# EAGLE design Temporizador (EAGLE 6.4)
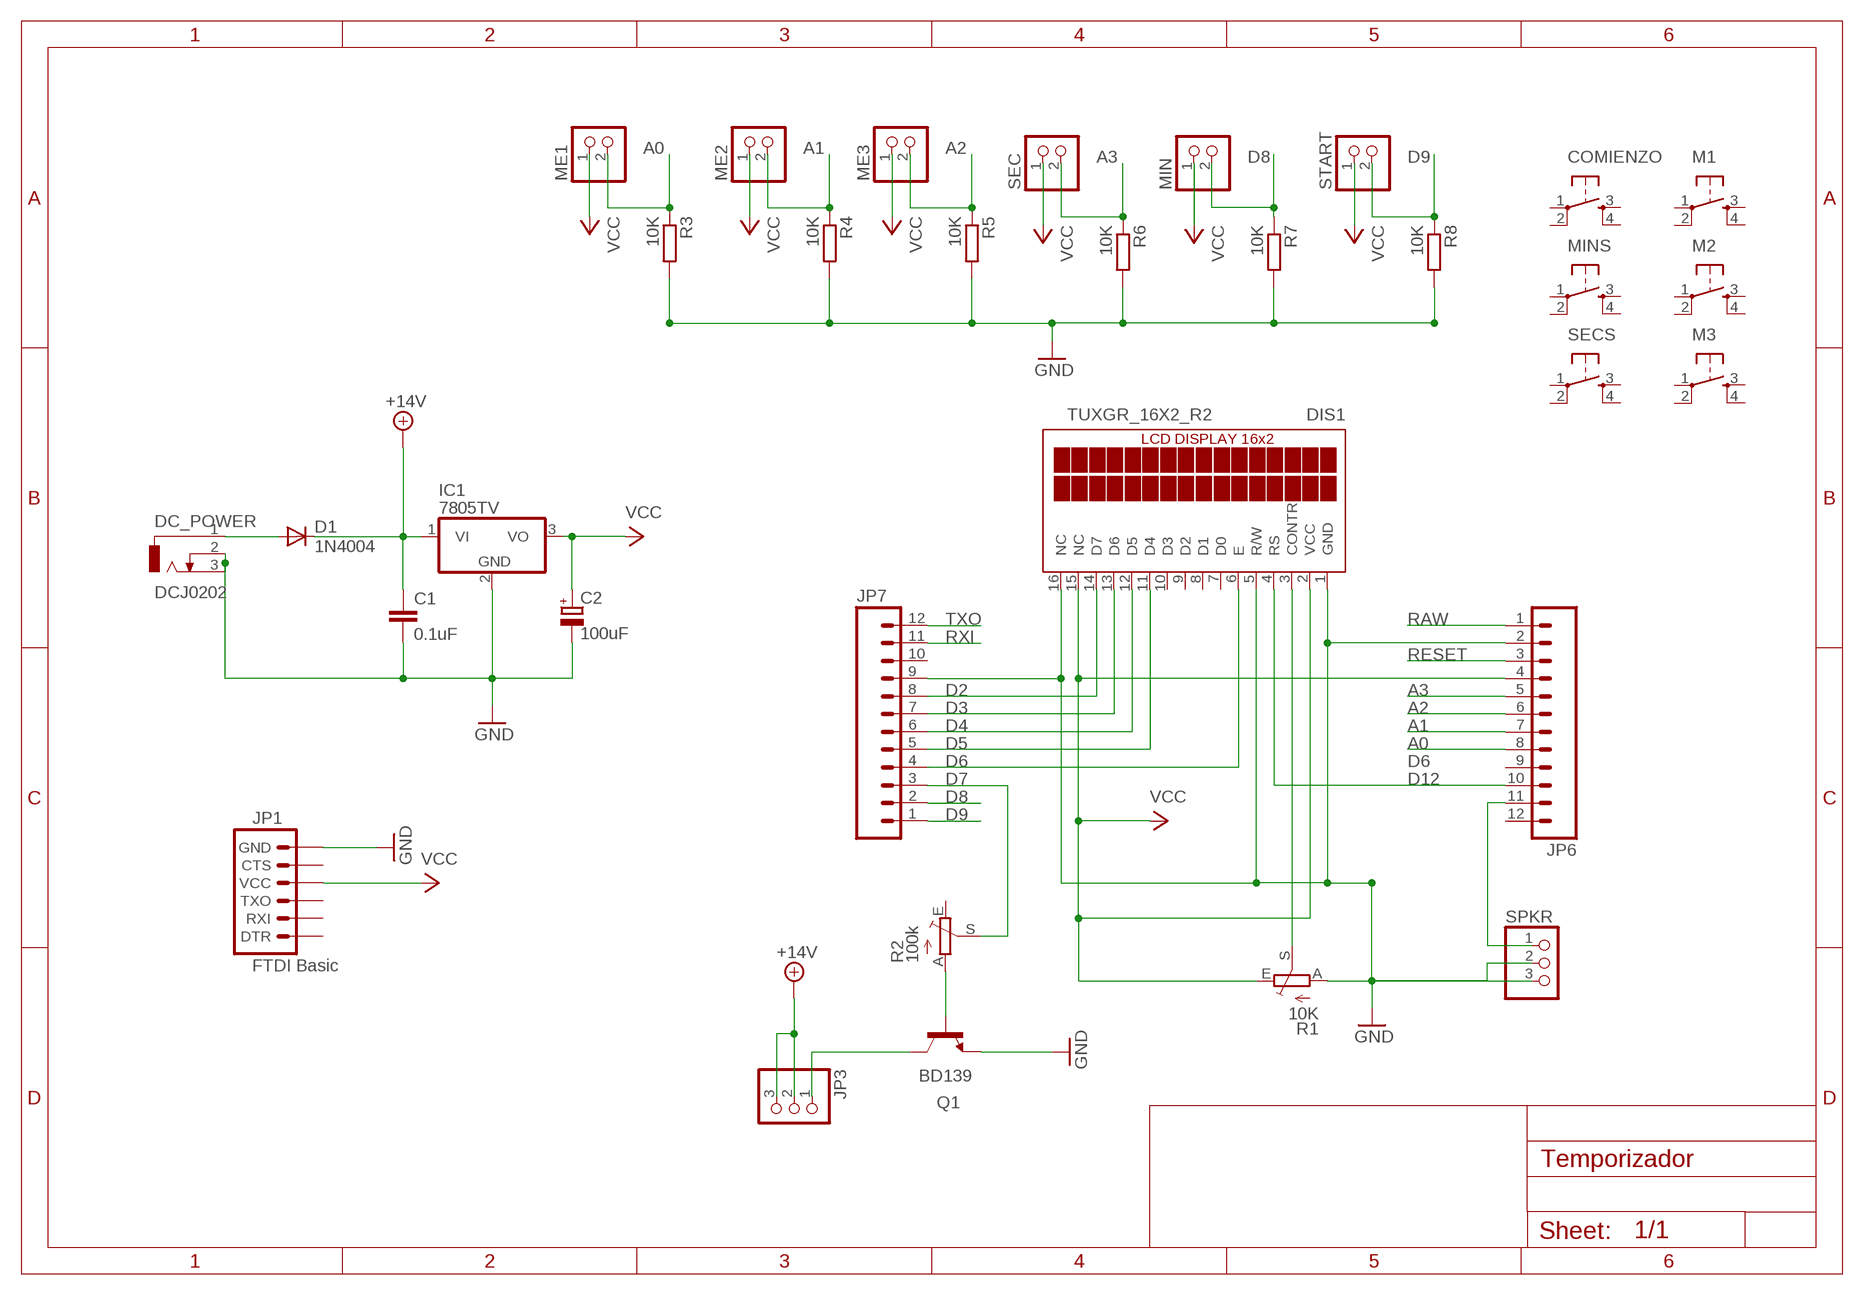
[diagram p0: schematic, sheet 1]

## Parts
C1  0.1uF  C-EU025-030X050  [C025-030X050]
C2  100uF  CPOL-EUE2.5-7  [E2,5-7]
COMIENZO  TAC_SWITCHPTH  [TACTILE-PTH]
D1  1N4004  [DO41-10]
DC_POWER  DCJ0202  [DCJ0202]
DIS1  TUXGR_16X2_R2  [TUXGR_16X2_R2]
IC1  7805TV  [TO220V]
JP1  FTDI Basic  ARDUINO_SERIAL_PROGRAMPTH  [1X06]
JP3  PINHD-1X3  [1X03]
JP6  M12LONGPADS  [1X12_LONGPADS]
JP7  M12LONGPADS  [1X12_LONGPADS]
M1  TAC_SWITCHPTH  [TACTILE-PTH]
M2  TAC_SWITCHPTH  [TACTILE-PTH]
M3  TAC_SWITCHPTH  [TACTILE-PTH]
ME1  PINHD-1X2  [1X02]
ME2  PINHD-1X2  [1X02]
ME3  PINHD-1X2  [1X02]
MIN  PINHD-1X2  [1X02]
MINS  TAC_SWITCHPTH  [TACTILE-PTH]
Q1  BD139  [TO126]
R1  10K  TRIM_EU-CA6V  [CA6V]
R2  100k  TRIM_EU-CA6V  [CA6V]
R3  10K  R-EU_0309/12  [0309/12]
R4  10K  R-EU_0309/12  [0309/12]
R5  10K  R-EU_0309/12  [0309/12]
R6  10K  R-EU_0309/12  [0309/12]
R7  10K  R-EU_0309/12  [0309/12]
R8  10K  R-EU_0309/12  [0309/12]
SEC  PINHD-1X2  [1X02]
SECS  TAC_SWITCHPTH  [TACTILE-PTH]
SPKR  PINHD-1X3  [1X03]
START  PINHD-1X2  [1X02]

## Nets
+14V: C1.1 D1.C IC1.1(VI) JP3.2 JP3.3
A0: JP6.8 ME1.2 R3.1
A1: JP6.7 ME2.2 R4.1
A2: JP6.6 ME3.2 R5.1
A3: JP6.5 R6.1 SEC.2
D2: DIS1.14(D7) JP7.8
D3: DIS1.13(D6) JP7.7
D4: DIS1.12(D5) JP7.6
D5: DIS1.11(D4) JP7.5
D6: DIS1.6(E) JP7.4
D7: JP7.3 R2.S
D8: JP7.2 MIN.2 R7.1
D9: JP7.1 R8.1 START.2
D12: DIS1.4(RS) JP6.10
GND: C1.2 C2.- DC_POWER.2 DC_POWER.3 DIS1.1(GND) DIS1.5(R/W) DIS1.16(NC) IC1.2(GND) JP1.6(GND) JP6.2 JP7.9 Q1.1(E) R1.A R3.2 R4.2 R5.2 R6.2 R7.2 R8.2 SPKR.2 SPKR.3
N$1: DIS1.3(CONTR) R1.S
N$2: JP6.11 SPKR.1
N$3: Q1.3(B) R2.A
N$4: JP3.1 Q1.2(C)
N$5: D1.A DC_POWER.1
RAW [vcc]: JP6.1
RESET: JP6.3
RXI: JP7.11
TXO: JP7.12
VCC [vcc]: C2.+ DIS1.2(VCC) DIS1.15(NC) IC1.3(VO) JP1.4(VCC) JP6.4 ME1.1 ME2.1 ME3.1 MIN.1 R1.E SEC.1 START.1
Unconnected: COMIENZO.1 COMIENZO.2 COMIENZO.3 COMIENZO.4 DIS1.7(D0) DIS1.8(D1) DIS1.9(D2) DIS1.10(D3) JP1.1(DTR) JP1.2(RXI) JP1.3(TXO) JP1.5(CTS) JP6.9 JP6.12 JP7.10 M1.1 M1.2 M1.3 M1.4 M2.1 M2.2 M2.3 M2.4 M3.1 M3.2 M3.3 M3.4 MINS.1 MINS.2 MINS.3 MINS.4 R2.E SECS.1 SECS.2 SECS.3 SECS.4

## Library data of the parts
C1 = rcl:C-EU: CAPACITOR, European symbol
C2 = rcl:CPOL-EU: POLARIZED CAPACITOR, European symbol
COMIENZO M1-M3 MINS SECS = SparkFun-Electromechanical:TAC_SWITCH: Momentary Switch Button commonly used for reset or general input. Spark Fun Electronics SKU : COM-00097 SMT- SWCH-08247
D1 = diode:1N4004: DIODE general purpose rectifier, 1 A
DC_POWER = con-jack:DCJ0202: DC POWER JACK Source: DCJ0202.pdf; OC_FARNELL: unknown; OC_NEWARK: unknown
DIS1 = display-lcd:TUXGR_16X2_R2: Tuxgraphics LCD display 16x2 characters reflective, without background light Source: tuxgr_12x2_r2.pdf; OC_FARNELL: unknown; OC_NEWARK: unknown
IC1 = linear:78*: Positive VOLTAGE REGULATOR Source: http://cache.national.com/ds/LM/LM78L05.pdf http://www.fairchildsemi.com/ds/LM/LM7805.pdf
JP1 = SparkFun:ARDUINO_SERIAL_PROGRAM
JP3 SPKR = pinhead:PINHD-1X3: PIN HEADER
JP6 JP7 = SparkFun-Connectors:M12: Header 12 Standard 12-pin 0.1" header. Use with straight break away headers (SKU : PRT-00116), right angle break away headers (PRT-00553), swiss pins (PRT-00743), machine pins (PRT-00117), and female headers (PRT-00115).
ME1-ME3 MIN SEC START = pinhead:PINHD-1X2: PIN HEADER
Q1 = transistor-npn:BD139*: NPN Transistor
R1 R2 = pot:TRIM_EU-: POTENTIOMETER
R3-R8 = rcl:R-EU_: RESISTOR, European symbol

## Net classes
0 default: width 0.203 mm
1 vcc: width 0.254 mm

## Board
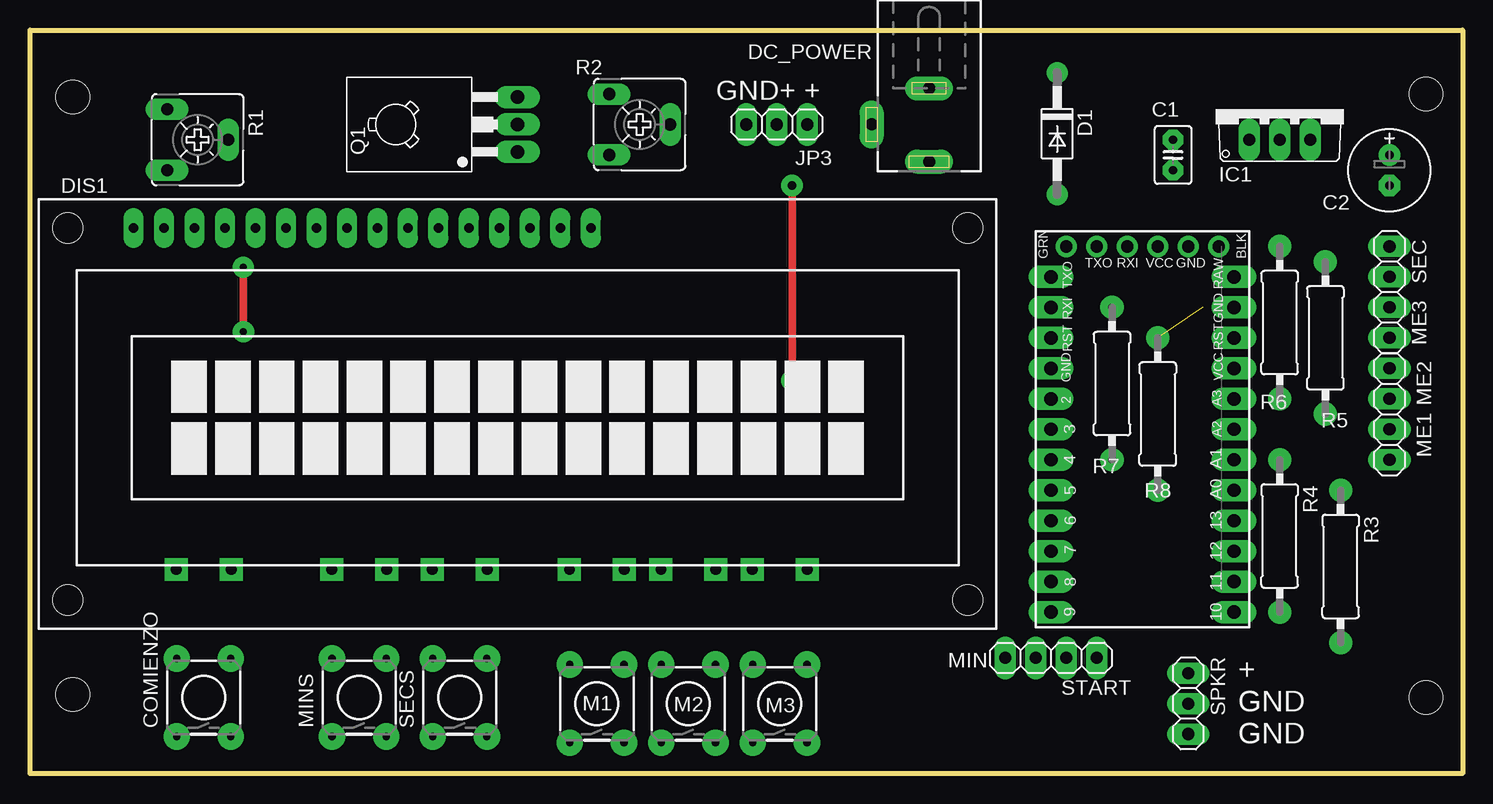
[diagram p1: board, top side]
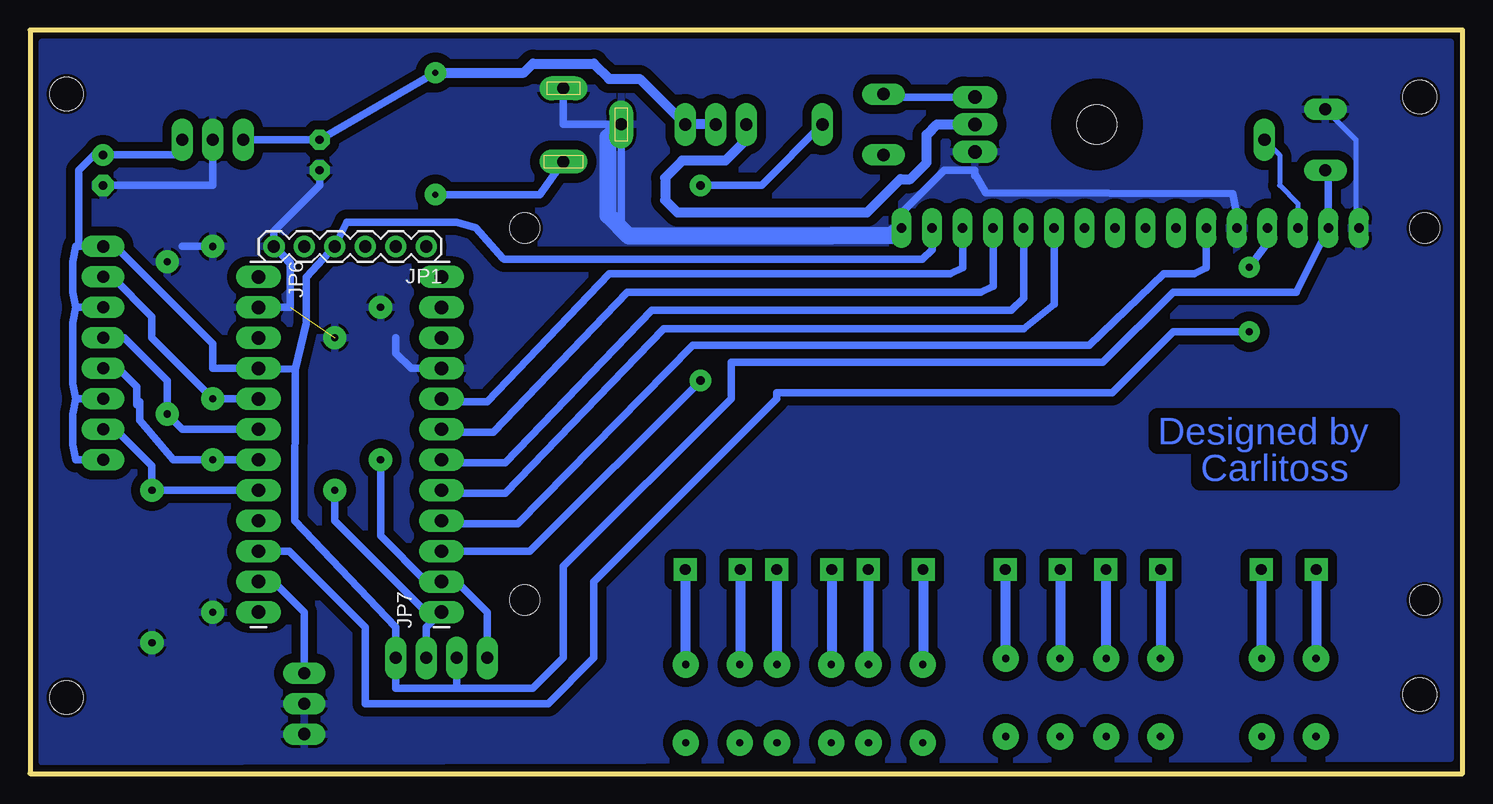
[diagram p2: board, bottom side, seen from below]

Size 119.38 x 61.98 mm. Coordinates in mm from the lower left corner, seen from the top.
Outline: 0,61.98 119.38,61.98 119.38,0 0,0 0,61.98
Copper layers (1*16): Top 0.035mm / dielectric 1.5mm / Bottom 0.035mm
Design rules "default *": minimum track width 8mil, minimum drill 20mil, track to track 30mil, track to pad 25mil, pad to pad 25mil, via to via 20mil, smd to smd 8mil, copper to edge 10mil, drill to drill 8mil, minimum pad ring 15mil, minimum via ring 20mil, stop-mask expansion 4mil, vias tented up to drill 20mil, thermal gap 10mil
Holes 2.8 mm at 3.56,6.6 3.56,56.39 116.33,56.64 116.33,6.35

### Footprints (pad centres in the part's own frame; a part is rotated, then mirrored left to right if it is on the bottom)
C025-030X050 = drill 0.7 pad 1.676 octagon: 1 -1.27,0; 2 1.27,0
E2,5-7 = drill 0.7 pad 1.778: + -1.27,0 | drill 0.7 pad 1.778 octagon: - 1.27,0
TACTILE-PTH = drill 0.6 pad 2.184: 1 -3.251,2.261; 2 3.251,2.261; 3 -3.251,-2.261; 4 3.251,-2.261
DO41-10 = drill 0.5 pad 1.778: A 5.08,0; C -5.08,0
DCJ0202 = drill 1 pad 2 long: 1 0,3.1; 2 4.8,0; 3 0,-3
TUXGR_16X2_R2 = drill 0.8 pad 1.676 long: 1 -32,15.5; 2 -29.46,15.5; 3 -26.92,15.5; 4 -24.38,15.5; 5 -21.84,15.5; 6 -19.3,15.5; 7 -16.76,15.5; 8 -14.22,15.5; 9 -11.68,15.5; 10 -9.14,15.5; 11 -6.6,15.5; 12 -4.06,15.5; 13 -1.52,15.5; 14 1.02,15.5; 15 3.56,15.5; 16 6.1,15.5 | hole 2.5: -37.5,-15.5; 37.5,-15.5; -37.5,15.5; 37.5,15.5
TO220V = drill 1.016 long: 1 -2.54,-2.54; 2 0,-2.54; 3 2.54,-2.54
1X06 = drill 1.016: 1 0,0; 2 2.54,0; 3 5.08,0; 4 7.62,0; 5 10.16,0; 6 12.7,0
1X03 = drill 1.016 long: 1 -2.54,0; 2 0,0; 3 2.54,0
1X12_LONGPADS = drill 1.118 pad 1.88 long: 1 0,0; 2 2.54,0; 3 5.08,0; 4 7.62,0; 5 10.16,0; 6 12.7,0; 7 15.24,0; 8 17.78,0; 9 20.32,0; 10 22.86,0; 11 25.4,0; 12 27.94,0
1X02 = drill 1.016 long: 1 -1.27,0; 2 1.27,0
TO126 = drill 1.118 long: 1 -2.286,-5.08; 2 0,-5.08; 3 2.286,-5.08 | hole 3.302: 0,5.08
CA6V = drill 1.016 long: A -2.54,-2.54; E 2.54,-2.54; S 0,2.54
0309/12 = drill 0.6 pad 1.93: 1 -6.35,0; 2 6.35,0

### Placement (x,y rotation side)
C1  95.25,51.56 270 top
C2  113.28,50.29 270 top
COMIENZO  14.48,6.35 90 top
D1  85.6,53.34 270 top
DC_POWER  74.93,54.1 180 top
DIS1  40.64,29.97 0 top
IC1  104.14,55.37 0 top
JP1  86.36,43.94 180 bottom
JP3  62.23,54.1 0 top
JP6  100.33,41.4 270 bottom
JP7  85.09,13.46 90 bottom
M1  47.24,5.84 90 top
M2  54.86,5.84 90 top
M3  62.48,5.84 90 top
ME1  113.28,27.43 90 top
ME2  113.28,32.51 90 top
ME3  113.28,37.59 270 top
MIN  82.55,9.65 180 top
MINS  27.43,6.35 90 top
Q1  35.56,54.1 90 top
R1  13.97,52.83 270 top
R2  50.8,54.1 270 top
R3  109.22,17.27 270 top
R4  104.14,19.81 270 top
R5  107.95,36.32 90 top
R6  104.14,37.59 90 top
R7  90.17,32.51 90 top
R8  93.98,29.97 90 top
SEC  113.28,42.67 270 top
SECS  35.81,6.35 90 top
SPKR  96.52,5.84 270 top
START  87.63,9.65 180 top

### Tracks (layer width: path | path; a pad name or v marks a point on that pad's centre or on a via)
+14V
  Bottom 0.61: D1.C C1.1 IC1.1
  Bottom 0.813: D1.C 78.23,58.42 77.47,59.18 72.39,59.18 71.12,57.91 68.58,57.91 JP3.3 JP3.2
A0
  Bottom 0.61: JP6.8 R3.1 109.22,25.65 112.01,28.45 113.03,28.45 ME1.2
A1
  Bottom 0.61: JP6.7 R4.1 104.16,26.18 107.46,26.18 110.24,29.46 110.24,30.99 110.49,30.73 110.49,32.26 112.01,33.78 ME2.2
A2
  Bottom 0.61: JP6.6 106.68,28.7 R5.1 107.95,32.77 111.51,36.32 ME3.2
A3
  Bottom 0.61: JP6.5 R6.1 109.22,36.32 109.22,38.1 112.52,41.4 SEC.2
D2
  Bottom 0.61: DIS1.14 41.66,42.16 42.67,41.66 71.12,41.66 81.28,30.99 84.84,30.99 JP7.8
D3
  Bottom 0.61: DIS1.13 39.12,40.64 40.13,40.13 69.6,40.13 80.77,28.45 84.84,28.45 JP7.7
D4
  Bottom 0.61: DIS1.12 36.58,39.62 37.59,38.61 67.56,38.61 79.76,25.91 84.84,25.91 JP7.6
D5
  Bottom 0.61: DIS1.11 34.04,39.11 36.58,37.08 66.55,37.08 79.76,23.37 84.84,23.37 JP7.5
D6
  Bottom 0.61: DIS1.6 21.34,42.16 22.35,41.66 24.89,41.66 31.12,35.72 64.14,35.72 78.74,20.83 84.84,20.83 JP7.4
D7  (via drill 0.7 pad 1.78)
  Top 0.61: v63.5,49.02 v63.5,32.77
  Bottom 0.61: R2.S 58.42,49.02 v63.5,49.02 | v63.5,32.77 77.72,18.54 JP7.3
D8
  Bottom 0.61: MIN.2 81.28,13.46 83.82,16 JP7.2 86.36,16 90.17,19.81 R7.1
D9
  Bottom 0.61: START.2 86.36,12.19 JP7.1 86.36,13.46 93.98,21.08 R8.1
D12  (via drill 0.6 pad 1.78)
  Top 0.61: v17.77,42.21 v17.78,36.83
  Bottom 0.61: DIS1.4 16.26,44.19 v17.77,42.21 | v17.78,36.83 24.13,36.83 29.21,31.75 57.15,31.75 57.15,31.24 72.39,16 72.39,9.65 76.2,5.84 91.44,5.84 91.44,12.19 97.79,18.54 JP6.10
GND  (1 unrouted)
  Bottom 0.406: R1.A 8.89,52.83 8.89,45.72 DIS1.1
  Bottom 0.61: 70.13,45.47 DC_POWER.2 74.93,54.1 DC_POWER.3 | C1.2 95.25,49.02 99.06,45.21 JP1.6 97.66,42.47 | 40.64,49.99 40.64,50.29 43.18,50.29 46.99,46.48 46.99,45.21 | 40.64,49.99 40.64,49.83 | DIS1.5 18.8,46.61 19.13,48.34 39.72,48.41 40.64,49.99 | JP7.9 87.63,33.78 88.9,35.05 88.9,36.32 | IC1.2 104.14,49.02 C2.- | R6.2 106.68,43.94 | JP6.2 97.71,38.86 97.71,42.62 99.04,43.95 99.04,44 99.08,44.04
  Bottom 1.422: DIS1.16 46.96,45.47 47.59,44.84 52.56,44.84 52.59,44.8 69.47,44.8 71.19,46.52 71.19,53.04 DC_POWER.2
  pour Bottom: 1.02,60.96 118.36,60.96 118.36,1.02 1.02,1.27
N$1
  Bottom 0.406: R1.S 15.24,51.56 15.24,49.02 13.72,47.5 DIS1.3
N$2
  Bottom 0.61: SPKR.1 96.52,13.46 99.06,16 JP6.11
N$3
  Bottom 0.61: Q1.3 48.01,56.39 R2.A
N$4
  Bottom 0.813: JP3.1 59.69,52.83 61.44,51.08 65.03,51.08 66.46,49.65 66.46,47.8 65.43,46.77 62.08,46.77 62.07,46.77 49.62,46.77 46.84,49.56 46.02,49.56 44.65,50.92 44.65,53.27 43.82,54.1 Q1.2
N$5
  Bottom 0.61: DC_POWER.1 76.91,48.26 D1.A
N$8  (via drill 0.9)
  Bottom 0.813: v12.19,17.02 12.19,9.4
N$9  (via drill 0.9)
  Bottom 0.813: v16.76,17.02 16.76,9.4
N$10  (via drill 0.9)
  Bottom 0.813: v25.15,17.02 25.15,9.4
N$11  (via drill 0.9)
  Bottom 0.813: v29.72,17.02 29.72,9.4
N$12  (via drill 0.9)
  Bottom 0.813: v33.53,17.02 33.53,9.4
N$13  (via drill 0.9)
  Bottom 0.813: v38.1,17.02 38.1,9.4
N$14  (via drill 0.9)
  Bottom 0.813: v44.96,17.02 44.96,8.89
N$15  (via drill 0.9)
  Bottom 0.813: v49.53,17.02 49.53,8.89
N$16  (via drill 0.9)
  Bottom 0.813: v52.58,17.02 52.58,8.89
N$17  (via drill 0.9)
  Bottom 0.813: v57.15,17.02 57.15,8.89
N$18  (via drill 0.9)
  Bottom 0.813: v60.2,17.02 60.2,8.89
N$19  (via drill 0.9)
  Bottom 0.813: v64.77,17.02 64.77,8.89
N$21
  Bottom 0.61: 46.62,45.15 46.56,45.21
VCC
  Bottom 0.61: 97.3,33.72 96.36,37.55 96.36,41.36 JP1.4 92.96,45.97 83.82,45.97 82.23,45.48 79.99,42.97 79.87,42.87 45.03,42.88 44.2,43.68 DIS1.15 | 97.3,33.72 JP6.4 104.14,33.78 104.14,35.81 112.01,43.69 113.03,43.69 SEC.1 | 113.03,43.94 SEC.1 | SEC.1 115.32,43.94 | 115.32,43.94 115.57,43.94 115.82,42.67 115.82,40.13 115.57,38.86 | ME3.1 115.57,38.86 | 115.57,38.86 115.82,37.59 115.82,32.51 115.57,31.24 | ME2.1 115.57,31.24 | 115.57,31.24 115.82,29.97 115.82,27.43 115.57,26.16 ME1.1 | 97.3,33.72 97.26,33.77 97.33,21.08 88.9,12.19 START.1 88.9,7.11 83.82,7.11 | MIN.1 83.82,7.11 | R1.E 11.18,50.04 DIS1.2 13.84,40.12 24.13,40.13 29.97,34.29 60.96,34.29 60.96,31.24 74.93,17.27 74.93,9.65 77.47,7.11 83.82,7.11 | IC1.3 106.68,51.56 C2.+ 114.05,51.56 115.32,50.29 115.32,43.94

### Text on the board
Bottom: Designed by | Carlitoss
tPlace: GND+ + | GRN | BLK | TXO | RXI | VCC | GND | TXO | RAW | RXI | GND | RST | RST | GND | VCC | 2 | A3 | 3 | A2 | 4 | A1 | 5 | A0 | 6 | 13 | 7 | 12 | 8 | 11 | 9 | 10 | + / GND / GND